# Altium project VM3300.PrjPCB
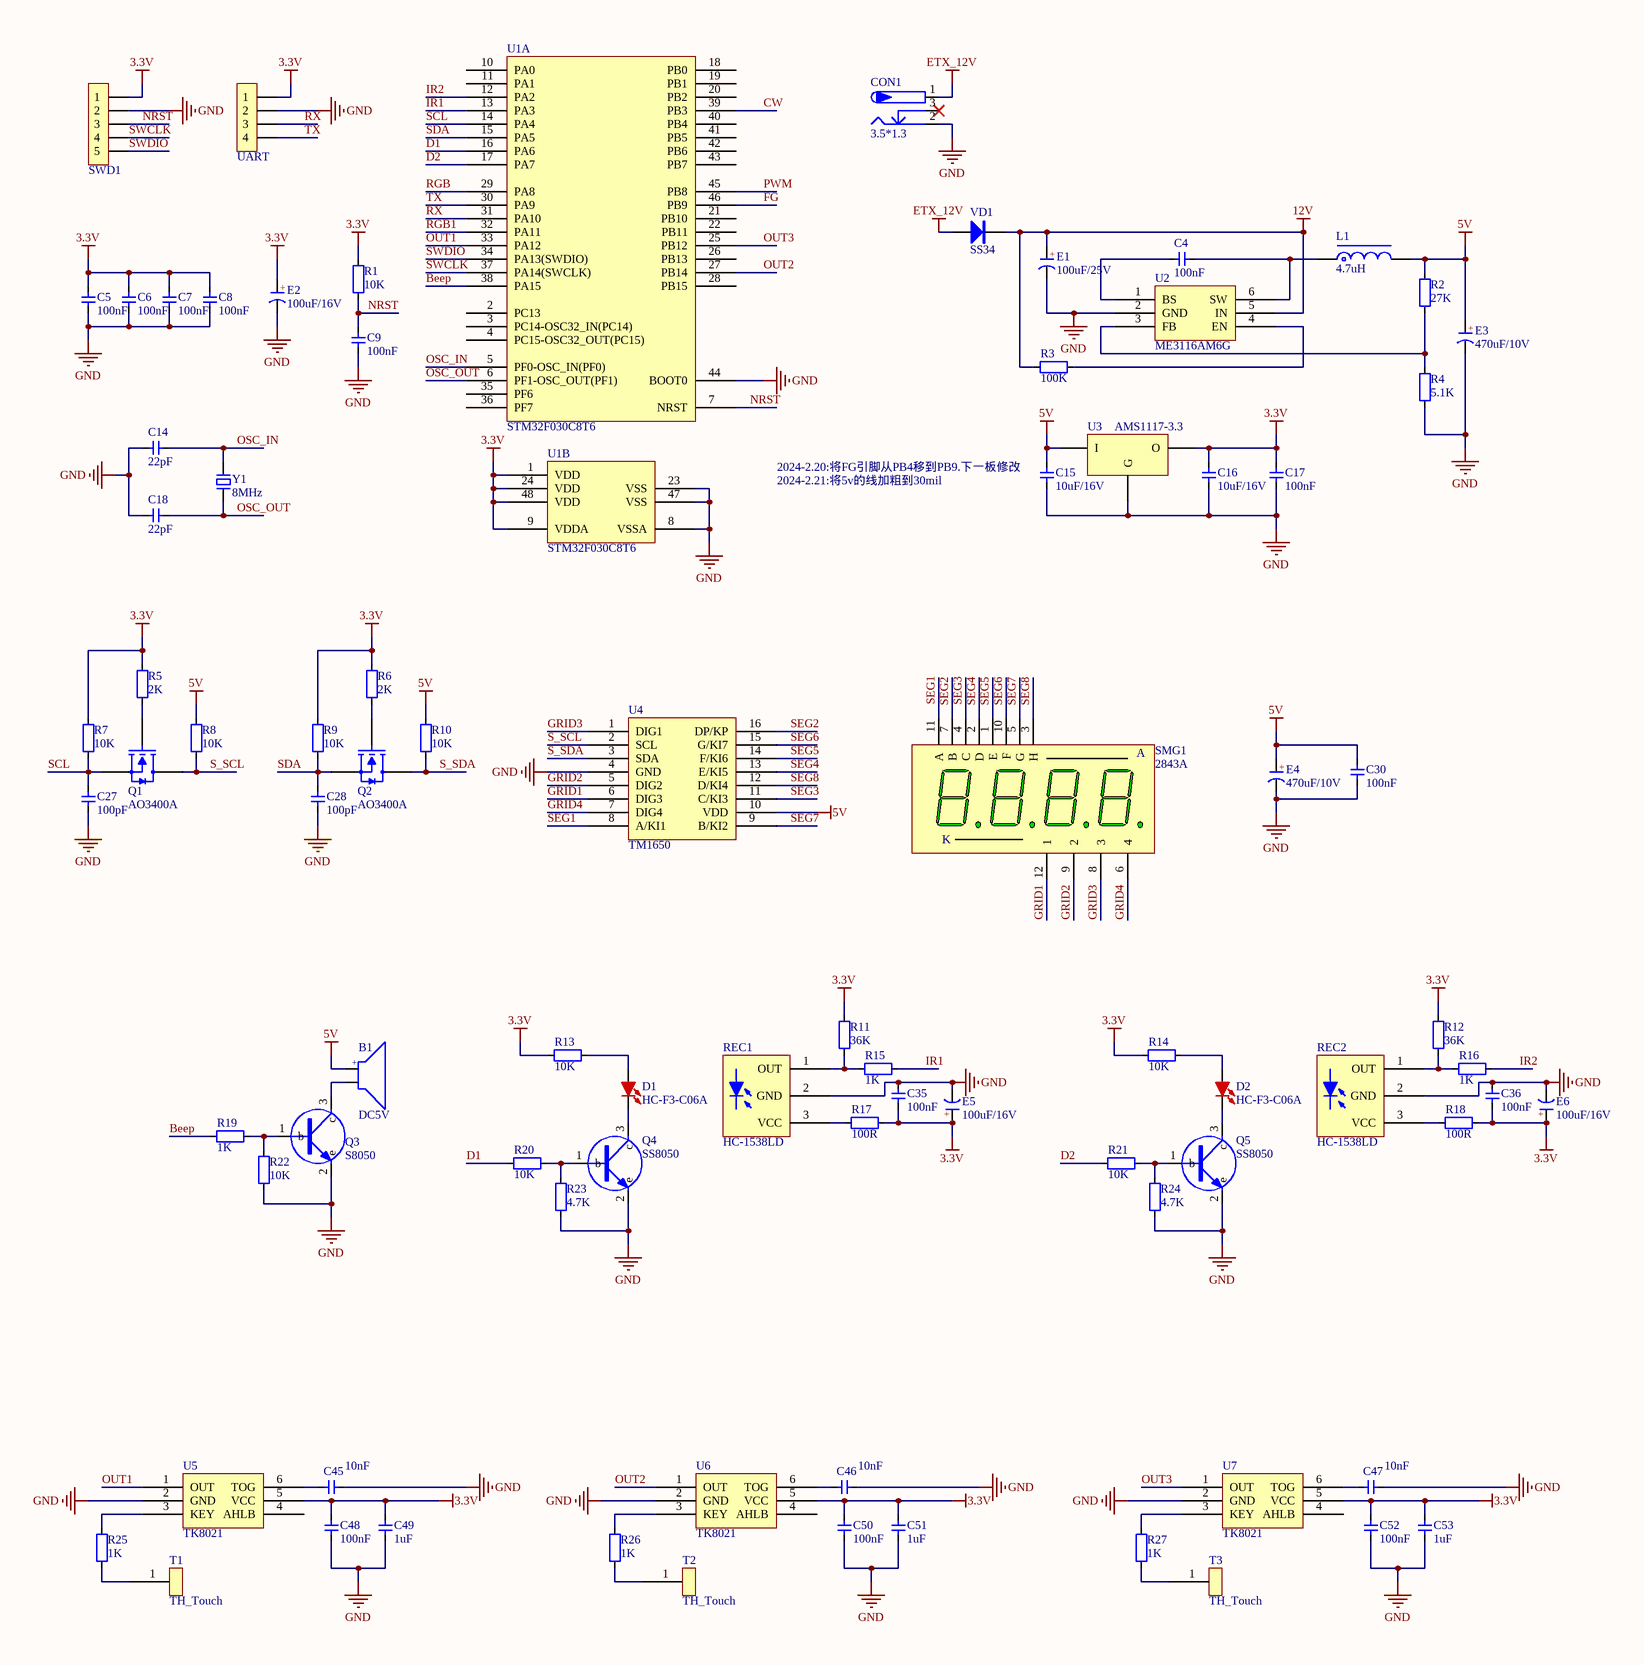
[diagram p0: VM3300_V0.1.SchDoc, left]
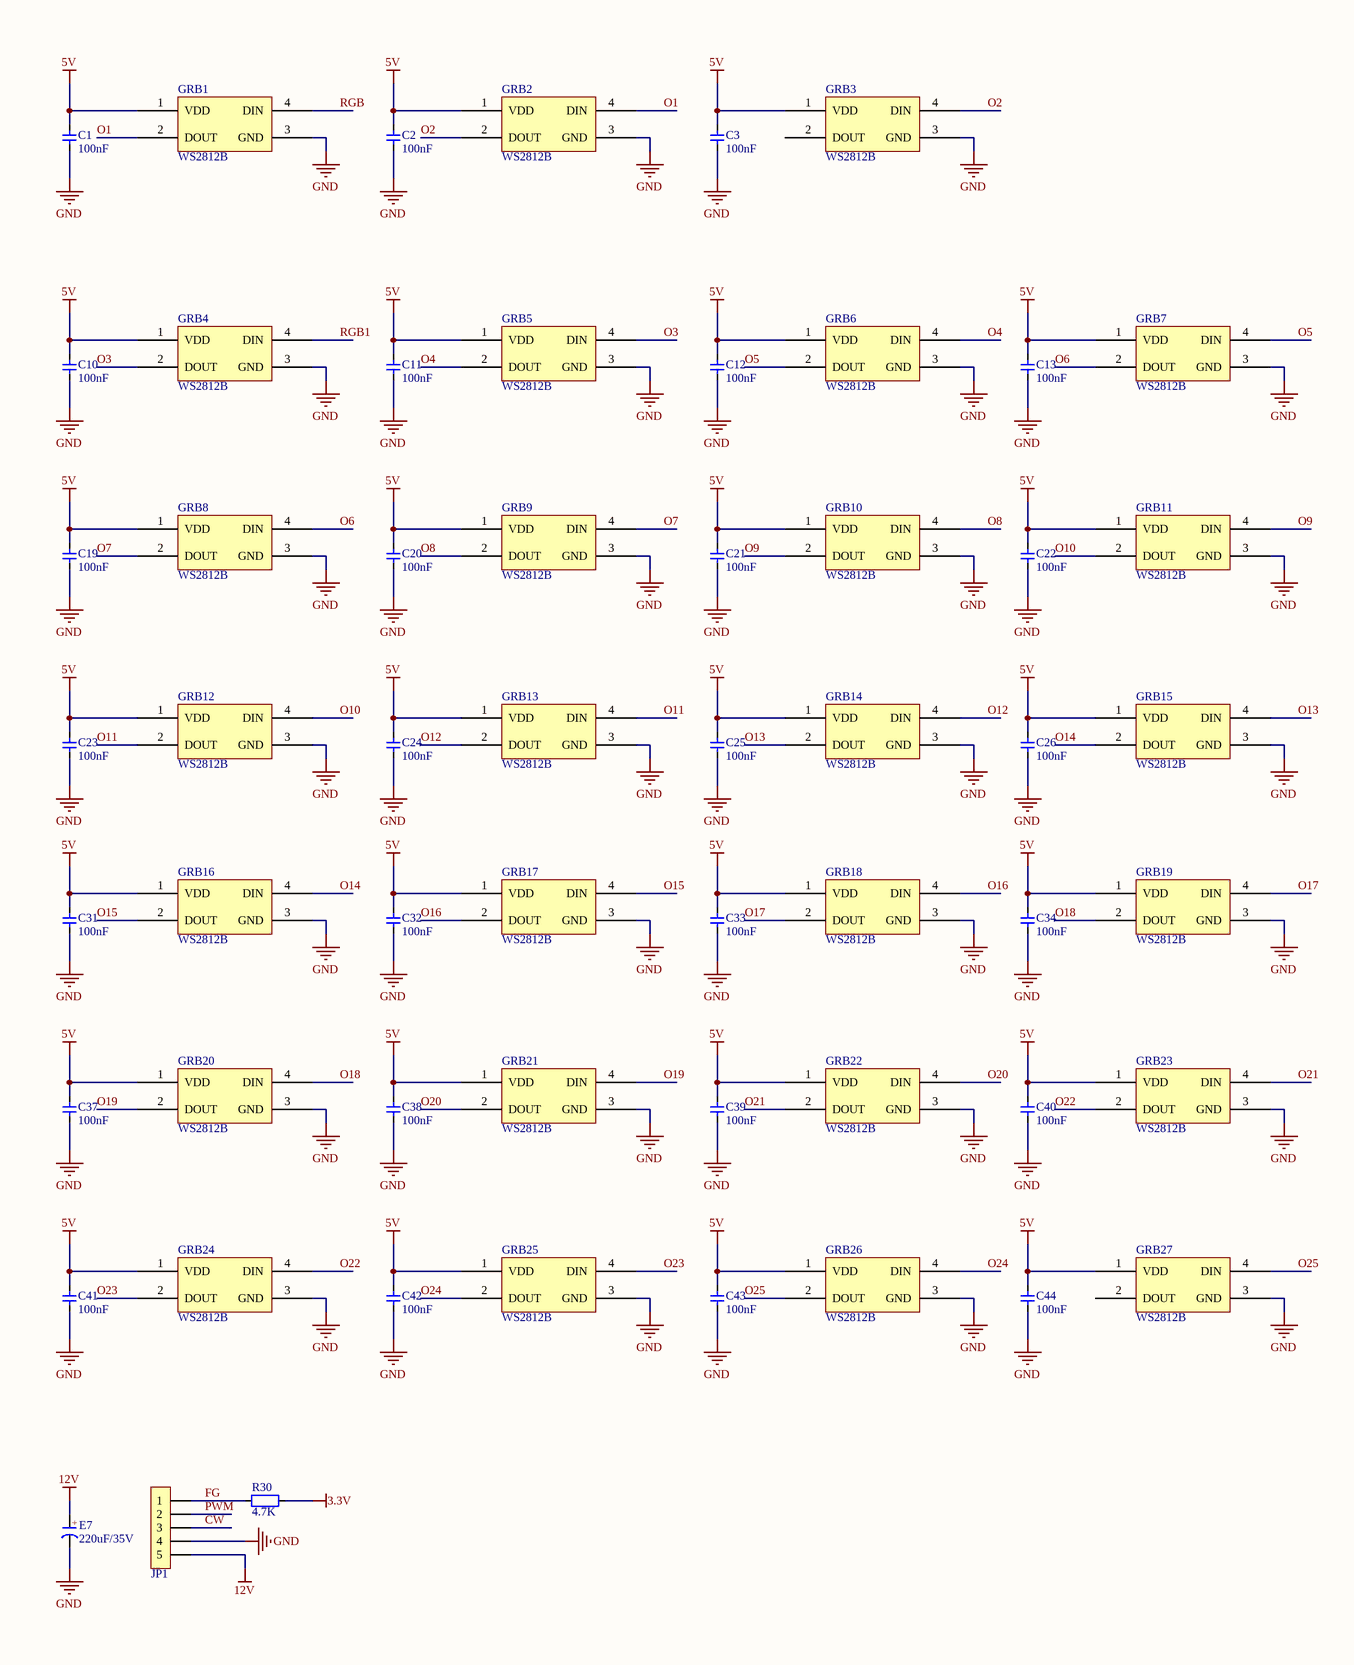
[diagram p1: VM3300_V0.1.SchDoc, right]
1 sheet, 142 parts. Net scope: global (net labels, ports and power ports of the same name join across sheets).
Board file: VM3300_V0.1.PcbDoc

## Sheet VM3300_V0.1.SchDoc
size A2

### Parts
B1  DC5V  [BEEP 7.6x12x7.5]
C1  100nF  [C 0603]
C2  100nF  [C 0603]
C3  100nF  [C 0603]
C4  100nF  [C 0603]
C5  100nF  [C 0603]
C6  100nF  [C 0603]
C7  100nF  [C 0603]
C8  100nF  [C 0603]
C9  100nF  [C 0603]
C10  100nF  [C 0603]
C11  100nF  [C 0603]
C12  100nF  [C 0603]
C13  100nF  [C 0603]
C14  22pF  [C 0603]
C15  10uF/16V  [C 0805]
C16  10uF/16V  [C 0805]
C17  100nF  [C 0603]
C18  22pF  [C 0603]
C19  100nF  [C 0603]
C20  100nF  [C 0603]
C21  100nF  [C 0603]
C22  100nF  [C 0603]
C23  100nF  [C 0603]
C24  100nF  [C 0603]
C25  100nF  [C 0603]
C26  100nF  [C 0603]
C27  100pF  [C 0603]
C28  100pF  [C 0603]
C30  100nF  [C 0603]
C31  100nF  [C 0603]
C32  100nF  [C 0603]
C33  100nF  [C 0603]
C34  100nF  [C 0603]
C35  100nF  [C 0603]
C36  100nF  [C 0603]
C37  100nF  [C 0603]
C38  100nF  [C 0603]
C39  100nF  [C 0603]
C40  100nF  [C 0603]
C41  100nF  [C 0603]
C42  100nF  [C 0603]
C43  100nF  [C 0603]
C44  100nF  [C 0603]
C45  10nF  [C 0603]
C46  10nF  [C 0603]
C47  10nF  [C 0603]
C48  100nF  [C 0603]
C49  1uF  [C 0603]
C50  100nF  [C 0603]
C51  1uF  [C 0603]
C52  100nF  [C 0603]
C53  1uF  [C 0603]
CON1  3.5*1.3  [DC-005]
D1  HC-F3-C06A  [HC-F3-C06A]
D2  HC-F3-C06A  [HC-F3-C06A]
E1  100uF/25V  [CAP 2.0*5*11 - BK]
E2  100uF/16V  [CAP 2.0*5*11 - BK]
E3  470uF/10V  [CAP 2.5*6.3*11.2 - BK]
E4  470uF/10V  [CAP 2.5*6.3*11.2 - BK]
E5  100uF/16V  [CAP 2.0*5*11 - BK]
E6  100uF/16V  [CAP 2.0*5*11 - BK]
E7  220uF/35V  [CAP 3.5*8*11.5 - BK]
GRB1  WS2812B  [WS2812B-3528]
GRB2  WS2812B  [WS2812B-3528]
GRB3  WS2812B  [WS2812B-3528]
GRB4  WS2812B  [WS2812B-3528]
GRB5  WS2812B  [WS2812B-3528]
GRB6  WS2812B  [WS2812B-3528]
GRB7  WS2812B  [WS2812B-3528]
GRB8  WS2812B  [WS2812B-3528]
GRB9  WS2812B  [WS2812B-3528]
GRB10  WS2812B  [WS2812B-3528]
GRB11  WS2812B  [WS2812B-3528]
GRB12  WS2812B  [WS2812B-3528]
GRB13  WS2812B  [WS2812B-3528]
GRB14  WS2812B  [WS2812B-3528]
GRB15  WS2812B  [WS2812B-3528]
GRB16  WS2812B  [WS2812B-3528]
GRB17  WS2812B  [WS2812B-3528]
GRB18  WS2812B  [WS2812B-3528]
GRB19  WS2812B  [WS2812B-3528]
GRB20  WS2812B  [WS2812B-3528]
GRB21  WS2812B  [WS2812B-3528]
GRB22  WS2812B  [WS2812B-3528]
GRB23  WS2812B  [WS2812B-3528]
GRB24  WS2812B  [WS2812B-3528]
GRB25  WS2812B  [WS2812B-3528]
GRB26  WS2812B  [WS2812B-3528]
GRB27  WS2812B  [WS2812B-3528]
JP1  HDR-1X5  [XH2.54-5P]  (value not drawn)
L1  4.7uH  [CD32]
Q1  AO3400A  [SOT23-3]
Q2  AO3400A  [SOT23-3]
Q3  S8050  [SOT23-3L]
Q4  SS8050  [SOT23-3L]
Q5  SS8050  [SOT23-3L]
R1  10K  [R 0603]
R2  27K  [R 0603]
R3  100K  [R 0603]
R4  5.1K  [R 0603]
R5  2K  [R 0603]
R6  2K  [R 0603]
R7  10K  [R 0603]
R8  10K  [R 0603]
R9  10K  [R 0603]
R10  10K  [R 0603]
R11  36K  [R 0603]
R12  36K  [R 0603]
R13  10K  [R 0603]
R14  10K  [R 0603]
R15  1K  [R 0603]
R16  1K  [R 0603]
R17  100R  [R 0603]
R18  100R  [R 0603]
R19  1K  [R 0603]
R20  10K  [R 0603]
R21  10K  [R 0603]
R22  10K  [R 0603]
R23  4.7K  [R 0603]
R24  4.7K  [R 0603]
R25  1K  [R 0603]
R26  1K  [R 0603]
R27  1K  [R 0603]
R30  4.7K  [R 0603]
REC1  HC-1538LD  [HC-1538LD-W]
REC2  HC-1538LD  [HC-1538LD-W]
SMG1  2843A  [SMG 0.28_4P_JOANLAB]
SWD1  HDR-1X5  [SWD_JOANLAB]  (value not drawn)
T1  TH_Touch  [TH_Touch]
T2  TH_Touch  [TH_Touch]
T3  TH_Touch  [TH_Touch]
U1  STM32F030C8T6  [STM32F030C8T6]  (parts A,B of 2)
U2  ME3116AM6G  [ME3116AM6G]
U3  AMS1117-3.3  [AMS1117-3.3]
U4  TM1650  [TM1650]
U5  TK8021  [TK8021]
U6  TK8021  [TK8021]
U7  TK8021  [TK8021]
UART  HDR-1X4  [XH2.54-4P]  (value not drawn)
VD1  SS34  [SMA]
Y1  8MHz  [XTAL-49S SMD]

### Nets
3.3V: C5.2 C6.2 C7.2 C8.2 C16.2 C17.2 C35.1 C36.1 C48.2 C49.2 C50.2 C51.2 C52.2 C53.2 E2.1(A) E5.1(A) E6.1(A) R1.2 R5.2 R6.2 R7.2 R9.2 R11.2 R12.2 R13.1 R14.1 R17.2 R18.2 R30.2 SWD1.1 U1.1(VDD) U1.9(VDDA) U1.24(VDD) U1.48(VDD) U3.2(O) U5.5(VCC) U6.5(VCC) U7.5(VCC) UART.1
5V: B1.1 C1.2 C2.2 C3.2 C10.2 C11.2 C12.2 C13.2 C15.2 C19.2 C20.2 C21.2 C22.2 C23.2 C24.2 C25.2 C26.2 C30.2 C31.2 C32.2 C33.2 C34.2 C37.2 C38.2 C39.2 C40.2 C41.2 C42.2 C43.2 C44.2 E3.1(A) E4.1(A) GRB1.1(VDD) GRB2.1(VDD) GRB3.1(VDD) GRB4.1(VDD) GRB5.1(VDD) GRB6.1(VDD) GRB7.1(VDD) GRB8.1(VDD) GRB9.1(VDD) GRB10.1(VDD) GRB11.1(VDD) GRB12.1(VDD) GRB13.1(VDD) GRB14.1(VDD) GRB15.1(VDD) GRB16.1(VDD) GRB17.1(VDD) GRB18.1(VDD) GRB19.1(VDD) GRB20.1(VDD) GRB21.1(VDD) GRB22.1(VDD) GRB23.1(VDD) GRB24.1(VDD) GRB25.1(VDD) GRB26.1(VDD) GRB27.1(VDD) L1.2 R2.2 R8.2 R10.2 U3.3(I) U4.10(VDD)
12V: E1.1(A) E7.1(A) JP1.5 R3.1 U2.5(IN) VD1.2(K)
ETX_12V: CON1.1 VD1.1(A)
GND: C1.1 C2.1 C3.1 C5.1 C6.1 C7.1 C8.1 C9.1 C10.1 C11.1 C12.1 C13.1 C14.1 C15.1 C16.1 C17.1 C18.1 C19.1 C20.1 C21.1 C22.1 C23.1 C24.1 C25.1 C26.1 C27.1 C28.1 C30.1 C31.1 C32.1 C33.1 C34.1 C35.2 C36.2 C37.1 C38.1 C39.1 C40.1 C41.1 C42.1 C43.1 C44.1 C45.2 C46.2 C47.2 C48.1 C49.1 C50.1 C51.1 C52.1 C53.1 CON1.2 E1.2(K) E2.2(K) E3.2(K) E4.2(K) E5.2(K) E6.2(K) E7.2(K) GRB1.3(GND) GRB2.3(GND) GRB3.3(GND) GRB4.3(GND) GRB5.3(GND) GRB6.3(GND) GRB7.3(GND) GRB8.3(GND) GRB9.3(GND) GRB10.3(GND) GRB11.3(GND) GRB12.3(GND) GRB13.3(GND) GRB14.3(GND) GRB15.3(GND) GRB16.3(GND) GRB17.3(GND) GRB18.3(GND) GRB19.3(GND) GRB20.3(GND) GRB21.3(GND) GRB22.3(GND) GRB23.3(GND) GRB24.3(GND) GRB25.3(GND) GRB26.3(GND) GRB27.3(GND) JP1.4 Q3.2(e) Q4.2(e) Q5.2(e) R4.1 R22.1 R23.1 R24.1 REC1.2(GND) REC2.2(GND) SWD1.2 U1.8(VSSA) U1.23(VSS) U1.44(BOOT0) U1.47(VSS) U2.2(GND) U3.1(G) U4.4(GND) U5.2(GND) U6.2(GND) U7.2(GND) UART.2
Beep: R19.1 U1.38(PA15)
CW: JP1.3 U1.39(PB3)
D1: R20.1 U1.16(PA6)
D2: R21.1 U1.17(PA7)
FG: JP1.1 R30.1 U1.46(PB9)
GRID1: SMG1.12(1) U4.6(DIG3)
GRID2: SMG1.9(2) U4.5(DIG2)
GRID3: SMG1.8(3) U4.1(DIG1)
GRID4: SMG1.6(4) U4.7(DIG4)
IR1: R15.2 U1.13(PA3)
IR2: R16.2 U1.12(PA2)
NRST: C9.2 R1.1 SWD1.3 U1.7(NRST)
O1: GRB1.2(DOUT) GRB2.4(DIN)
O2: GRB2.2(DOUT) GRB3.4(DIN)
O3: GRB4.2(DOUT) GRB5.4(DIN)
O4: GRB5.2(DOUT) GRB6.4(DIN)
O5: GRB6.2(DOUT) GRB7.4(DIN)
O6: GRB7.2(DOUT) GRB8.4(DIN)
O7: GRB8.2(DOUT) GRB9.4(DIN)
O8: GRB9.2(DOUT) GRB10.4(DIN)
O9: GRB10.2(DOUT) GRB11.4(DIN)
O10: GRB11.2(DOUT) GRB12.4(DIN)
O11: GRB12.2(DOUT) GRB13.4(DIN)
O12: GRB13.2(DOUT) GRB14.4(DIN)
O13: GRB14.2(DOUT) GRB15.4(DIN)
O14: GRB15.2(DOUT) GRB16.4(DIN)
O15: GRB16.2(DOUT) GRB17.4(DIN)
O16: GRB17.2(DOUT) GRB18.4(DIN)
O17: GRB18.2(DOUT) GRB19.4(DIN)
O18: GRB19.2(DOUT) GRB20.4(DIN)
O19: GRB20.2(DOUT) GRB21.4(DIN)
O20: GRB21.2(DOUT) GRB22.4(DIN)
O21: GRB22.2(DOUT) GRB23.4(DIN)
O22: GRB23.2(DOUT) GRB24.4(DIN)
O23: GRB24.2(DOUT) GRB25.4(DIN)
O24: GRB25.2(DOUT) GRB26.4(DIN)
O25: GRB26.2(DOUT) GRB27.4(DIN)
OSC_IN: C14.2 U1.5(PF0-OSC_IN(PF0)) Y1.2
OSC_OUT: C18.2 U1.6(PF1-OSC_OUT(PF1)) Y1.1
OUT1: U1.33(PA12) U5.1(OUT)
OUT2: U1.27(PB14) U6.1(OUT)
OUT3: U1.25(PB12) U7.1(OUT)
PWM: JP1.2 U1.45(PB8)
RGB: GRB1.4(DIN) U1.29(PA8)
RGB1: GRB4.4(DIN) U1.32(PA11)
RX: U1.31(PA10) UART.3
S_SCL: Q1.2(D) R8.1 U4.2(SCL)
S_SDA: Q2.2(D) R10.1 U4.3(SDA)
SCL: C27.2 Q1.3(S) R7.1 U1.14(PA4)
SDA: C28.2 Q2.3(S) R9.1 U1.15(PA5)
SEG1: SMG1.11(A) U4.8(A/KI1)
SEG2: SMG1.7(B) U4.16(DP/KP)
SEG3: SMG1.4(C) U4.11(C/KI3)
SEG4: SMG1.2(D) U4.13(E/KI5)
SEG5: SMG1.1(E) U4.14(F/KI6)
SEG6: SMG1.10(F) U4.15(G/KI7)
SEG7: SMG1.5(G) U4.9(B/KI2)
SEG8: SMG1.3(H) U4.12(D/KI4)
SWCLK: SWD1.4 U1.37(PA14(SWCLK))
SWDIO: SWD1.5 U1.34(PA13(SWDIO))
TX: U1.30(PA9) UART.4
NetB1_2: B1.2 Q3.3(c)
NetC4_1: C4.1 U2.1(BS)
NetC4_2: C4.2 L1.1 U2.6(SW)
NetC45_1: C45.1 U5.6(TOG)
NetC46_1: C46.1 U6.6(TOG)
NetC47_1: C47.1 U7.6(TOG)
NetD1_1: D1.1(A) R13.2
NetD1_2: D1.2(K) Q4.3(c)
NetD2_1: D2.1(A) R14.2
NetD2_2: D2.2(K) Q5.3(c)
NetQ1_1: Q1.1(G) R5.1
NetQ2_1: Q2.1(G) R6.1
NetQ3_1: Q3.1(b) R19.2 R22.2
NetQ4_1: Q4.1(b) R20.2 R23.2
NetQ5_1: Q5.1(b) R21.2 R24.2
NetR2_1: R2.1 R4.2 U2.3(FB)
NetR3_2: R3.2 U2.4(EN)
NetR11_1: R11.1 R15.1 REC1.1(OUT)
NetR12_1: R12.1 R16.1 REC2.1(OUT)
NetR17_1: R17.1 REC1.3(VCC)
NetR18_1: R18.1 REC2.3(VCC)
NetR25_1: R25.1 T1.1
NetR25_2: R25.2 U5.3(KEY)
NetR26_1: R26.1 T2.1
NetR26_2: R26.2 U6.3(KEY)
NetR27_1: R27.1 T3.1
NetR27_2: R27.2 U7.3(KEY)

Not connected (* = marked no-connect by the designer): CON1 3*; GRB3 2(DOUT); GRB27 2(DOUT); U1 2(PC13) 3(PC14-OSC32_IN(PC14)) 4(PC15-OSC32_OUT(PC15)) 10(PA0) 11(PA1) 18(PB0) 19(PB1) 20(PB2) 21(PB10) 22(PB11) 26(PB13) 28(PB15) 35(PF6) 36(PF7) 40(PB4) 41(PB5) 42(PB6) 43(PB7); U5 4(AHLB); U6 4(AHLB); U7 4(AHLB)

### Notes on the sheet
- 2024-2.20:将FG引脚从PB4移到PB9.下一板修改
- 2024-2.21:将5v的线加粗到30mil
- (in symbol 2843A) K
- (in symbol BEEP) +
- (in symbol C-CAP) +

### Library data of the parts
B1 = BEEP: 蜂鸣器; 版权归属: 源创客; BOM名称: 蜂鸣器; 学习资源: www.ooocke.com
C1-C28 C30-C53 = C: 无极性贴片电容; 版权归属: 源创客; BOM名称: 无极性贴片电容; 学习资源: www.ooocke.com
CON1 = P-DC: 低压电源接口; BOM名称: DC电源接口; 版权归属: 源创客; 学习资源: www.ooocke.com
D1 D2 = HC-F3-C06A: 红外发射管
E1-E7 = C-CAP: 直插电解电容; 版权归属: 源创客; BOM名称: 直插电解电容; 学习资源: www.ooocke.com
JP1 SWD1 = Header 5: 5P接插件; 版权归属: 源创客; BOM名称: 5P接插件; 学习资源: www.ooocke.com
L1 = L-CD: 贴片功率电感; BOM名称: 功率电感; 版权归属: 源创客; 学习资源: www.ooocke.com
Q1 Q2 = AO3400A: N-MOS
Q3-Q5 = NPN
R1-R27 R30 = R: 贴片电阻; 版权归属: 源创客; BOM名称: 贴片电阻; 学习资源: www.ooocke.com
REC1 REC2 = HC-1538LD: 红外接收管
SMG1 = 2843A: JOANLAB-0.28寸4位共阴数码管; 版权归属: 源创客; BOM名称: 0.28寸4位共阴; 学习资源: www.ooocke.com
T1-T3 = TH_Touch: 触摸弹簧，用于触摸感应
U1 = STM32F030C8T6: STM32F030采用ARM Cortex内核，运算速度高达48 MHz。STM32F030是STM32系列中价格最低的产品，具有全套外设，例如高速12位ADC、先进且灵活的定时器、日历RTC和通信接口（例如 I?C、USART和SPI）。
U2 = ME3116AM6G: DC-DC电源芯片  24-40V->5V
U3 = AMS1117-3.3: 转3.3V电压
U4 = TM1650: TM1650是一种带键盘扫描接口的LED（发光二极管显示器）驱动控制专用IC,内部集成有MCU / 数字接口、数据锁存器、LED驱动、键盘扫描等电路。
U5-U7 = TTP2233: 单通道自校正触摸感应芯片
UART = Header 4: 4P接插件; 版权归属: 源创客; BOM名称: 4P接插件; 学习资源: www.ooocke.com
VD1 = SS34: 肖特基二极管; 版权归属: 源创客; 属性: 40V/3A; BOM名称: 肖特基二极管; 学习资源: www.ooocke.com
Y1 = XTAL-2: 2脚晶振; 版权归属: 源创客; BOM名称: 2脚晶振; 学习资源: www.ooocke.com